# EAGLE schematic 8x8 (EAGLE 9.6.2)
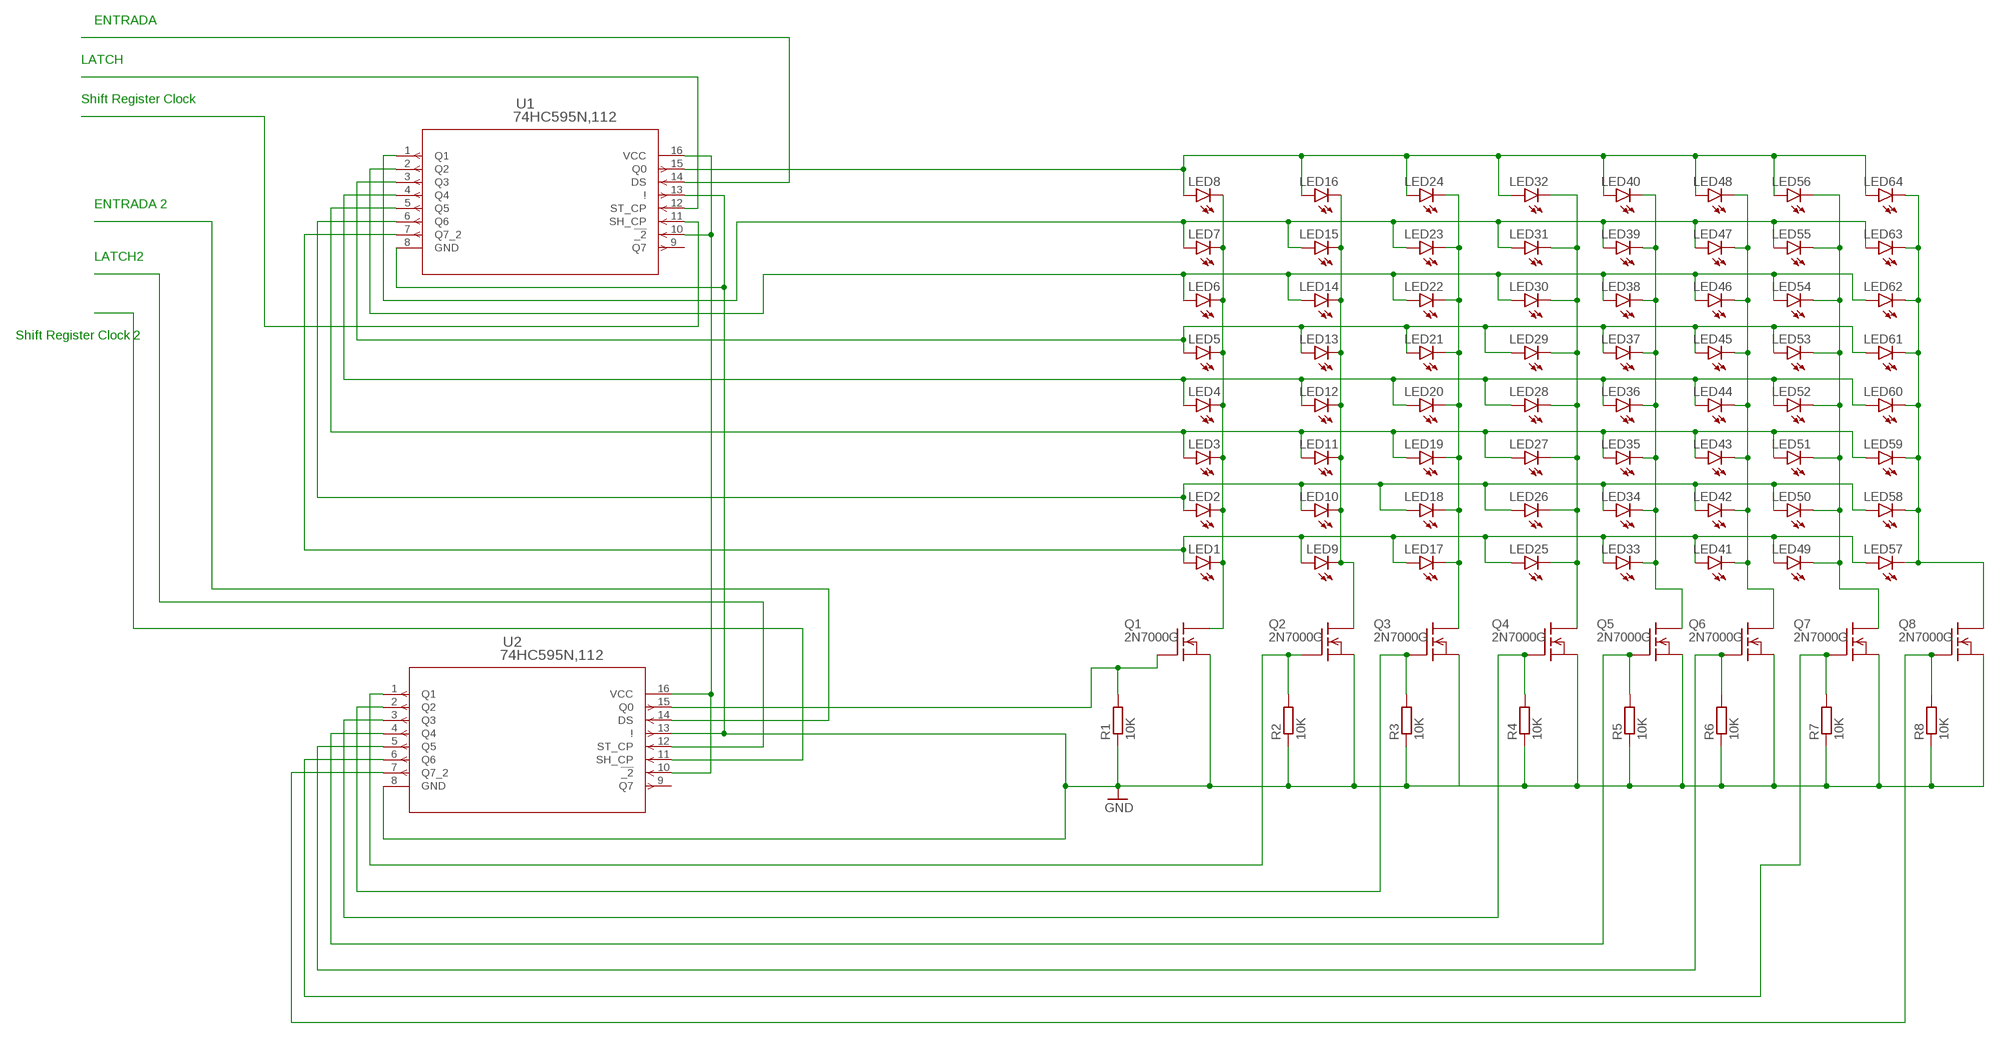
[diagram p0: schematic, sheet 1]

## Parts
LED1  LED3MM  [LED3MM]
LED2  LED3MM  [LED3MM]
LED3  LED3MM  [LED3MM]
LED4  LED3MM  [LED3MM]
LED5  LED3MM  [LED3MM]
LED6  LED3MM  [LED3MM]
LED7  LED3MM  [LED3MM]
LED8  LED3MM  [LED3MM]
LED9  LED3MM  [LED3MM]
LED10  LED3MM  [LED3MM]
LED11  LED3MM  [LED3MM]
LED12  LED3MM  [LED3MM]
LED13  LED3MM  [LED3MM]
LED14  LED3MM  [LED3MM]
LED15  LED3MM  [LED3MM]
LED16  LED3MM  [LED3MM]
LED17  LED3MM  [LED3MM]
LED18  LED3MM  [LED3MM]
LED19  LED3MM  [LED3MM]
LED20  LED3MM  [LED3MM]
LED21  LED3MM  [LED3MM]
LED22  LED3MM  [LED3MM]
LED23  LED3MM  [LED3MM]
LED24  LED3MM  [LED3MM]
LED25  LED3MM  [LED3MM]
LED26  LED3MM  [LED3MM]
LED27  LED3MM  [LED3MM]
LED28  LED3MM  [LED3MM]
LED29  LED3MM  [LED3MM]
LED30  LED3MM  [LED3MM]
LED31  LED3MM  [LED3MM]
LED32  LED3MM  [LED3MM]
LED33  LED3MM  [LED3MM]
LED34  LED3MM  [LED3MM]
LED35  LED3MM  [LED3MM]
LED36  LED3MM  [LED3MM]
LED37  LED3MM  [LED3MM]
LED38  LED3MM  [LED3MM]
LED39  LED3MM  [LED3MM]
LED40  LED3MM  [LED3MM]
LED41  LED3MM  [LED3MM]
LED42  LED3MM  [LED3MM]
LED43  LED3MM  [LED3MM]
LED44  LED3MM  [LED3MM]
LED45  LED3MM  [LED3MM]
LED46  LED3MM  [LED3MM]
LED47  LED3MM  [LED3MM]
LED48  LED3MM  [LED3MM]
LED49  LED3MM  [LED3MM]
LED50  LED3MM  [LED3MM]
LED51  LED3MM  [LED3MM]
LED52  LED3MM  [LED3MM]
LED53  LED3MM  [LED3MM]
LED54  LED3MM  [LED3MM]
LED55  LED3MM  [LED3MM]
LED56  LED3MM  [LED3MM]
LED57  LED3MM  [LED3MM]
LED58  LED3MM  [LED3MM]
LED59  LED3MM  [LED3MM]
LED60  LED3MM  [LED3MM]
LED61  LED3MM  [LED3MM]
LED62  LED3MM  [LED3MM]
LED63  LED3MM  [LED3MM]
LED64  LED3MM  [LED3MM]
Q1  2N7000G  [TO92-INLINE]
Q2  2N7000G  [TO92-INLINE]
Q3  2N7000G  [TO92-INLINE]
Q4  2N7000G  [TO92-INLINE]
Q5  2N7000G  [TO92-INLINE]
Q6  2N7000G  [TO92-INLINE]
Q7  2N7000G  [TO92-INLINE]
Q8  2N7000G  [TO92-INLINE]
R1  10K  R-EU_0204/2V  [0204V]
R2  10K  R-EU_0204/2V  [0204V]
R3  10K  R-EU_0204/2V  [0204V]
R4  10K  R-EU_0204/2V  [0204V]
R5  10K  R-EU_0204/2V  [0204V]
R6  10K  R-EU_0204/2V  [0204V]
R7  10K  R-EU_0204/2V  [0204V]
R8  10K  R-EU_0204/2V  [0204V]
U1  74HC595N,112  [SOT38-4_NXP]
U2  74HC595N,112  [SOT38-4_NXP]

## Nets
GND: Q1.1(SRC) Q2.1(SRC) Q3.1(SRC) Q4.1(SRC) Q5.1(SRC) Q6.1(SRC) Q7.1(SRC) Q8.1(SRC) R1.1 R2.1 R3.1 R4.1 R5.1 R6.1 R7.1 R8.1 U1.8(GND) U1.13(!) U2.8(GND) U2.13(!)
N$1: LED1.K(C) LED2.K(C) LED3.K(C) LED4.K(C) LED5.K(C) LED6.K(C) LED7.K(C) LED8.K(C) Q1.3(DRN)
N$2: Q1.2(GATE) R1.2 U2.15(Q0)
N$3: Q2.2(GATE) R2.2 U2.1(Q1)
N$4: LED9.K(C) LED10.K(C) LED11.K(C) LED12.K(C) LED13.K(C) LED14.K(C) LED15.K(C) LED16.K(C) Q2.3(DRN)
N$5: LED17.K(C) LED18.K(C) LED19.K(C) LED20.K(C) LED21.K(C) LED22.K(C) LED23.K(C) LED24.K(C) Q3.3(DRN)
N$6: LED25.K(C) LED26.K(C) LED27.K(C) LED28.K(C) LED29.K(C) LED30.K(C) LED31.K(C) LED32.K(C) Q4.3(DRN)
N$7: LED33.K(C) LED34.K(C) LED35.K(C) LED36.K(C) LED37.K(C) LED38.K(C) LED39.K(C) LED40.K(C) Q5.3(DRN)
N$8: LED41.K(C) LED42.K(C) LED43.K(C) LED44.K(C) LED45.K(C) LED46.K(C) LED47.K(C) LED48.K(C) Q6.3(DRN)
N$9: LED49.K(C) LED50.K(C) LED51.K(C) LED52.K(C) LED53.K(C) LED54.K(C) LED55.K(C) LED56.K(C) Q7.3(DRN)
N$10: LED57.K(C) LED58.K(C) LED59.K(C) LED60.K(C) LED61.K(C) LED62.K(C) LED63.K(C) LED64.K(C) Q8.3(DRN)
N$11: Q3.2(GATE) R3.2 U2.2(Q2)
N$12: Q4.2(GATE) R4.2 U2.3(Q3)
N$13: Q5.2(GATE) R5.2 U2.4(Q4)
N$14: Q6.2(GATE) R6.2 U2.5(Q5)
N$15: Q8.2(GATE) R8.2 U2.7(Q7_2)
N$16: U1.14(DS)
N$17: LED8.A LED16.A LED24.A LED32.A LED40.A LED48.A LED56.A LED64.A U1.15(Q0)
N$18: LED7.A LED15.A LED23.A LED31.A LED39.A LED47.A LED55.A LED63.A U1.1(Q1)
N$19: LED6.A LED14.A LED22.A LED30.A LED38.A LED46.A LED54.A LED62.A U1.2(Q2)
N$20: U1.12(ST_CP)
N$21: LED4.A LED12.A LED20.A LED28.A LED36.A LED44.A LED52.A LED60.A U1.4(Q4)
N$22: LED3.A LED11.A LED19.A LED27.A LED35.A LED43.A LED51.A LED59.A U1.5(Q5)
N$23: LED2.A LED10.A LED18.A LED26.A LED34.A LED42.A LED50.A LED58.A U1.6(Q6)
N$24: LED1.A LED9.A LED17.A LED25.A LED33.A LED41.A LED49.A LED57.A U1.7(Q7_2)
N$25: U1.10(!_2) U1.16(VCC) U2.10(!_2) U2.16(VCC)
N$26: U1.11(SH_CP)
N$27: U2.14(DS)
N$28: LED5.A LED13.A LED21.A LED29.A LED37.A LED45.A LED53.A LED61.A U1.3(Q3)
N$29: Q7.2(GATE) R7.2 U2.6(Q6)
N$30: U2.12(ST_CP)
N$31: U2.11(SH_CP)
Unconnected: U1.9(Q7) U2.9(Q7)

## Notes on the sheet
- ENTRADA
- LATCH
- Shift Register Clock
- ENTRADA 2
- LATCH2
- Shift Register Clock 2

## Library data of the parts
LED1-LED64 = led:LED: LED OSRAM: - CHIPLED LG R971, LG N971, LY N971, LG Q971, LY Q971, LO R971, LY R971 LH N974, LH R974 LS Q976, LO Q976, LY Q976 LO Q996 - Hyper CHIPLED LW Q18S LB Q993, LB Q99A, LB R99A - SideLED LS A670, LO A670, LY A670, LG A670, LP A670 LB A673, LV A673, LT A673, LW A673 LH A674 LY A675 LS A676, LA A676, LO A676, LY A676, LW A676 LS A679, LY A679, LG A679 - Hyper Micro SIDELED® LS Y876, LA Y876, LO Y876, LY Y876 LT Y87S - SmartLED LW L88C, LW L88S LB L89C, LB L89S, LG L890 LS L89K, LO L89K, LY L89K LS L896, LA L896, LO L896, LY L896 - TOPLED LS T670, LO T670, LY T670, LG T670, LP T670 LSG T670, LSP T670, LSY T670, LOP T670, LYG T670 LG T671, LOG T671, LSG T671 LB T673, LV T673, LT T673, LW T673 LH T674 LS T676, LA T676, LO T676, LY T676, LB T676, LH T676, LSB T676, LW T676 LB T67C, LV T67C, LT T67C, LS T67K, LO T67K, LY T67K, LW E67C LS E67B, LA E67B, LO E67B, LY E67B, LB E67C, LV E67C, LT E67C LW T67C LS T679, LY T679, LG T679 LS T770, LO T770, LY T770, LG T770, LP T770 LB T773, LV T773, LT T773, LW T773 LH T774 LS E675, LA E675, LY E675, LS T675 LS T776, LA T776, LO T776, LY T776, LB T776 LHGB T686 LT T68C, LB T68C - Hyper Mini TOPLED® LB M676 - Mini TOPLED Santana® LG M470 LS M47K, LO M47K, LY M47K Source: http://www.osram.convergy.de LUXEON: - LUMILED® LXK2-PW12-R00, LXK2-PW12-S00, LXK2-PW14-U00, LXK2-PW14-V00 LXK2-PM12-R00, LXK2-PM12-S00, LXK2-PM14-U00 LXK2-PE12-Q00, LXK2-PE12-R00, LXK2-PE12-S00, LXK2-PE14-T00, LXK2-PE14-U00 LXK2-PB12-K00, LXK2-PB12-L00, LXK2-PB12-M00, LXK2-PB14-N00, LXK2-PB14-P00, LXK2-PB14-Q00 LXK2-PR12-L00, LXK2-PR12-M00, LXK2-PR14-Q00, LXK2-PR14-R00 LXK2-PD12-Q00, LXK2-PD12-R00, LXK2-PD12-S00 LXK2-PH12-R00, LXK2-PH12-S00 LXK2-PL12-P00, LXK2-PL12-Q00, LXK2-PL12-R00 Source: www.luxeon.com KINGBRIGHT: KA-3528ASYC Source: www.kingbright.com
Q1-Q8 = 2N7000G:2N7000G: N-Channel Enhancement MOSFET 60V; 200mA; 5 ohm Check prices <https://pricing.snapeda.com/parts/2N7000G/ON%20Semiconductor/view-part?ref=eda>; AVAILABILITY: Bad; DESCRIPTION: N-Channel 60V 200mA (Ta) 350mW (Tc) Through Hole TO-92-3; MF: ON Semiconductor; MP: 2N7000G; PACKAGE: TO-92 ON; PRICE: None
R1-R8 = rcl:R-EU_: RESISTOR, European symbol; SPICEPREFIX: R
U1 U2 = 74hc595:74HC595N,112; BUILT_BY: EMA_UL_Team; MANUFACTURER_PART_NUMBER: 74HC595N,112; SOURCELIBRARY: NXP_2011-01-01; VENDOR: NXP